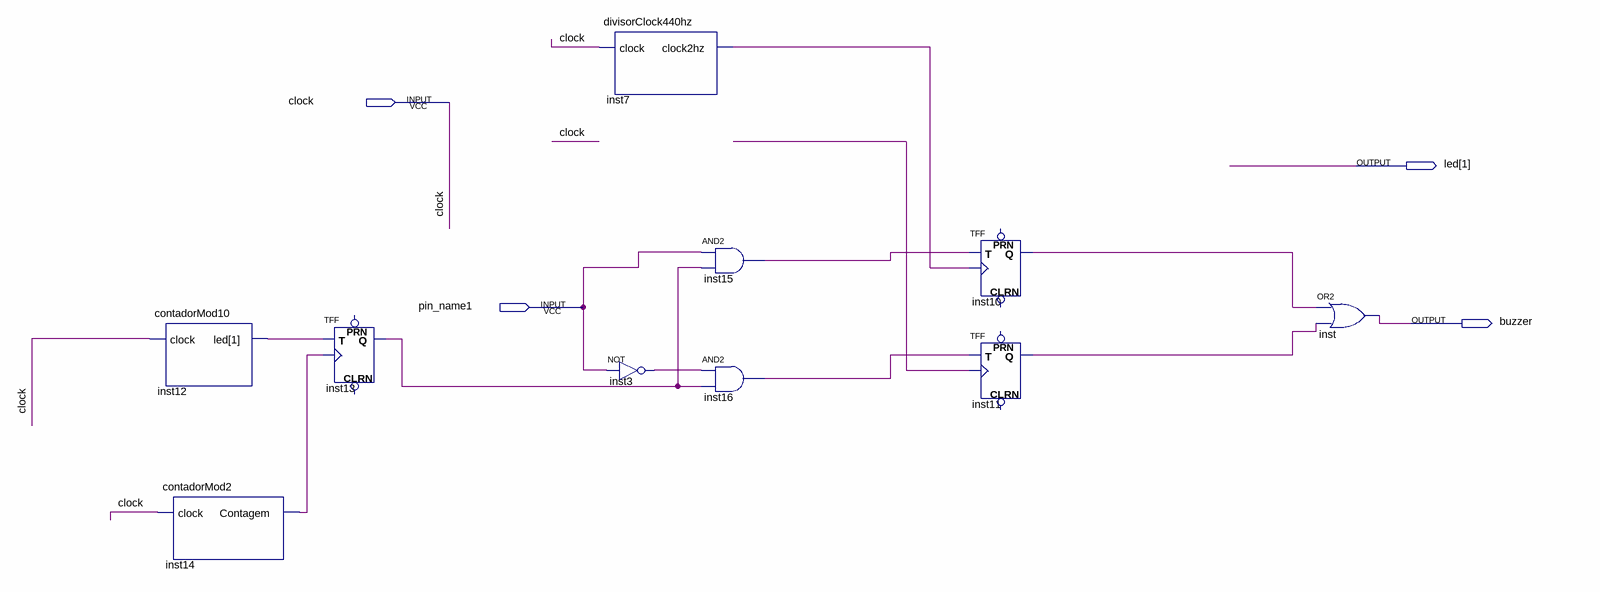
[diagram p0: schematic sheet]
// Quartus schematic testebuzzer.bdf as structural Verilog: 10 symbols, 4 pins
module testebuzzer (
  input  clock,
  input  pin_name1,
  output [1:1] led,
  output buzzer
);

  wire inst3_out, inst7_clock2hz, inst10_q, inst11_q, inst12_led, inst13_q, inst14_contagem, inst15_out,
       inst16_out, undriven;

  contadorMod10 inst12 (.clock(clock), .led(inst12_led));
  contadorMod2 inst14 (.clock(clock), .Contagem(inst14_contagem));
  TFF inst13 (.T(inst12_led), .CLK(inst14_contagem), .Q(inst13_q));  // open: PRN, CLRN
  divisorClock440hz inst7 (.clock(clock), .clock2hz(inst7_clock2hz));
  not inst3 (inst3_out, pin_name1);
  and inst15 (inst15_out, pin_name1, inst13_q);
  and inst16 (inst16_out, inst3_out, inst13_q);
  TFF inst10 (.T(inst15_out), .CLK(inst7_clock2hz), .Q(inst10_q));  // open: PRN, CLRN
  TFF inst11 (.T(inst16_out), .CLK(undriven), .Q(inst11_q));  // open: PRN, CLRN
  or inst (buzzer, inst10_q, inst11_q);
endmodule
